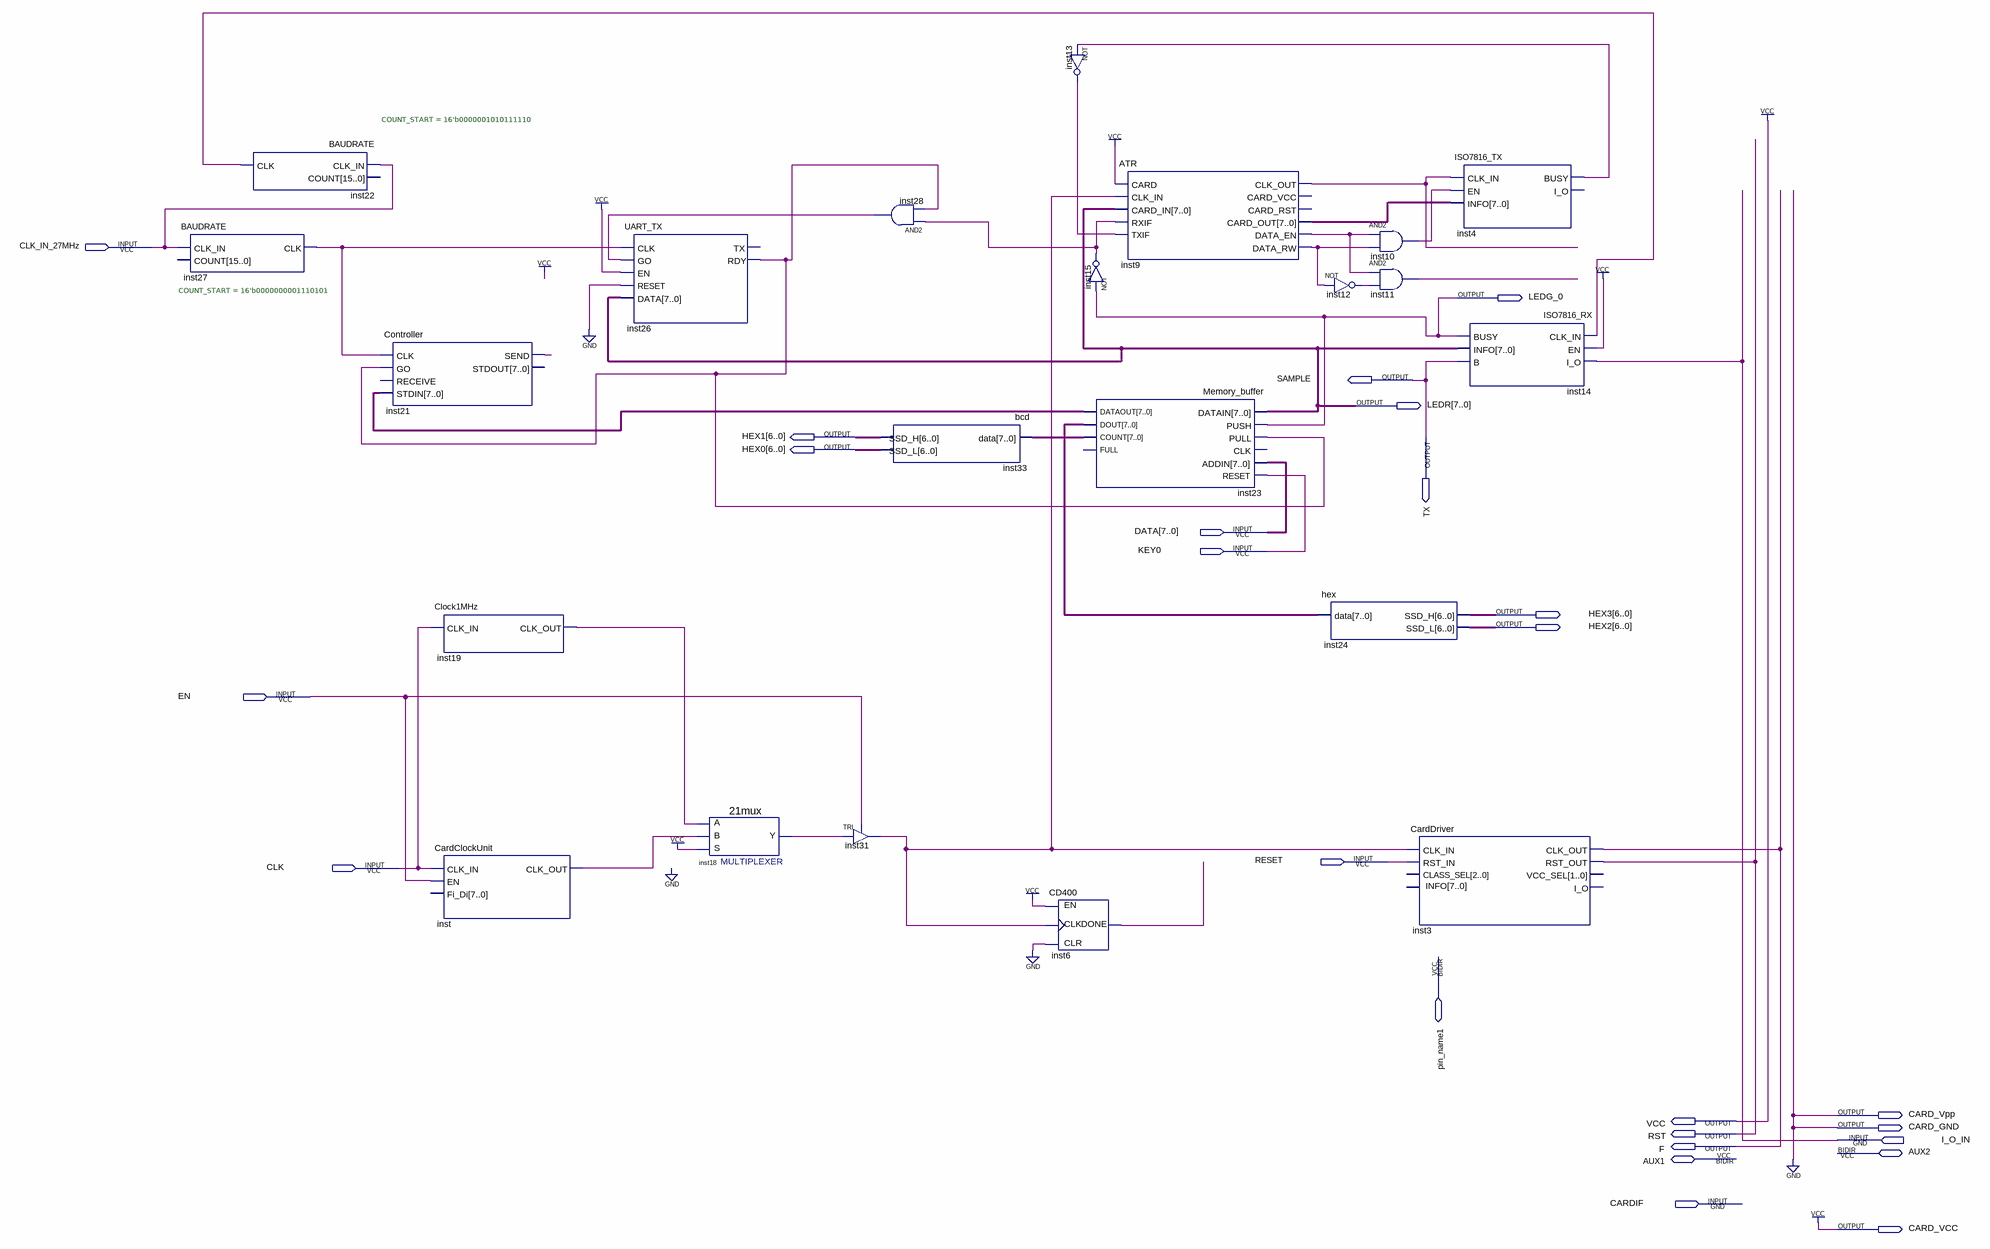
[diagram p0: schematic sheet]
// Quartus schematic Terminal.bdf as structural Verilog: 22 symbols, 25 pins
module Terminal (
  input  CLK_IN_27MHz,
  input  [7:0] DATA,
  input  KEY0,
  input  EN,
  input  RESET,
  input  CLK,
  input  I_O_IN,
  input  CARDIF,
  inout  pin_name1,
  inout  AUX2,
  inout  AUX1,
  output LEDG_0,
  output SAMPLE,
  output [7:0] LEDR,
  output [6:0] HEX1,
  output TX,
  output [6:0] HEX0,
  output [6:0] HEX3,
  output [6:0] HEX2,
  output CARD_Vpp,
  output VCC,
  output CARD_GND,
  output RST,
  output F,
  output CARD_VCC
);

  wire inst4_busy, inst6_done, inst9_clk_out, inst9_data_en, inst9_data_rw, inst10_out, inst11_out,
       inst12_out, inst13_out, inst15_out, inst18_y, inst19_clk_out, inst21_send, inst22_clk, inst26_rdy,
       inst27_clk, inst28_out, inst31_out, inst_clk_out;
  wire [7:0] inst9_card_out, inst23_count, inst23_dataout, inst23_dout;

  BAUDRATE #(.COUNT_START(16'b0000000001110101)) inst27 (.CLK_IN(CLK_IN_27MHz), .CLK(inst27_clk));  // open: COUNT
  BAUDRATE #(.COUNT_START(16'b0000001010111110)) inst22 (.CLK_IN(CLK_IN_27MHz), .CLK(inst22_clk));  // open: COUNT
  Controller inst21 (
    .CLK(inst27_clk), .GO(inst26_rdy), .STDIN(inst23_dataout), .SEND(inst21_send));  // open: RECEIVE, STDOUT
  Clock1MHz inst19 (.CLK_IN(CLK), .CLK_OUT(inst19_clk_out));
  CardClockUnit inst (.CLK_IN(CLK), .EN(EN), .CLK_OUT(inst_clk_out));  // open: Fi_Di
  UART_TX inst26 (
    .CLK(inst27_clk), .GO(inst28_out), .EN(1'b1), .RESET(1'b0), .DATA(LEDR), .RDY(inst26_rdy));  // open: TX
  \21mux  inst18 (.S(1'b1), .B(inst_clk_out), .A(inst19_clk_out), .Y(inst18_y));
  TRI inst31 (.IN(inst18_y), .OE(EN), .OUT(inst31_out));
  and inst28 (inst28_out, inst15_out, inst26_rdy);
  bcd inst33 (.data(inst23_count), .SSD_H(HEX1), .SSD_L(HEX0));
  CD400 inst6 (.CLR(1'b0), .EN(1'b1), .CLK(inst31_out), .DONE(inst6_done));
  not inst13 (inst13_out, inst4_busy);
  not inst15 (inst15_out, LEDG_0);
  Memory_buffer inst23 (
    .DATAIN(LEDR), .PUSH(LEDG_0), .PULL(inst26_rdy), .ADDIN(DATA), .RESET(KEY0), .DATAOUT(inst23_dataout),
    .DOUT(inst23_dout), .COUNT(inst23_count));  // open: CLK, FULL
  ATR inst9 (
    .CARD(1'b1), .CLK_IN(inst31_out), .CARD_IN(LEDR), .RXIF(inst15_out), .TXIF(inst13_out),
    .CLK_OUT(inst9_clk_out), .CARD_OUT(inst9_card_out), .DATA_EN(inst9_data_en), .DATA_RW(inst9_data_rw));  // open: CARD_VCC, CARD_RST
  not inst12 (inst12_out, inst9_data_rw);
  hex inst24 (.data(inst23_dout), .SSD_H(HEX3), .SSD_L(HEX2));
  and inst10 (inst10_out, inst9_data_en, inst9_data_rw);
  and inst11 (inst11_out, inst9_data_en, inst12_out);
  CardDriver inst3 (
    .CLK_IN(inst31_out), .RST_IN(RESET), .CLK_OUT(F), .RST_OUT(RST));  // open: CLASS_SEL, VCC_SEL, INFO, I_O
  ISO7816_TX inst4 (.CLK_IN(inst9_clk_out), .EN(inst10_out), .INFO(inst9_card_out), .BUSY(inst4_busy));  // open: I_O
  ISO7816_RX inst14 (.CLK_IN(inst22_clk), .EN(1'b1), .I_O(I_O_IN), .BUSY(LEDG_0), .INFO(LEDR), .B(SAMPLE));

  assign CARD_GND = 1'b0;
  assign CARD_VCC = 1'b1;
  assign CARD_Vpp = 1'b0;
  assign TX = SAMPLE;
  assign VCC = 1'b1;
endmodule
